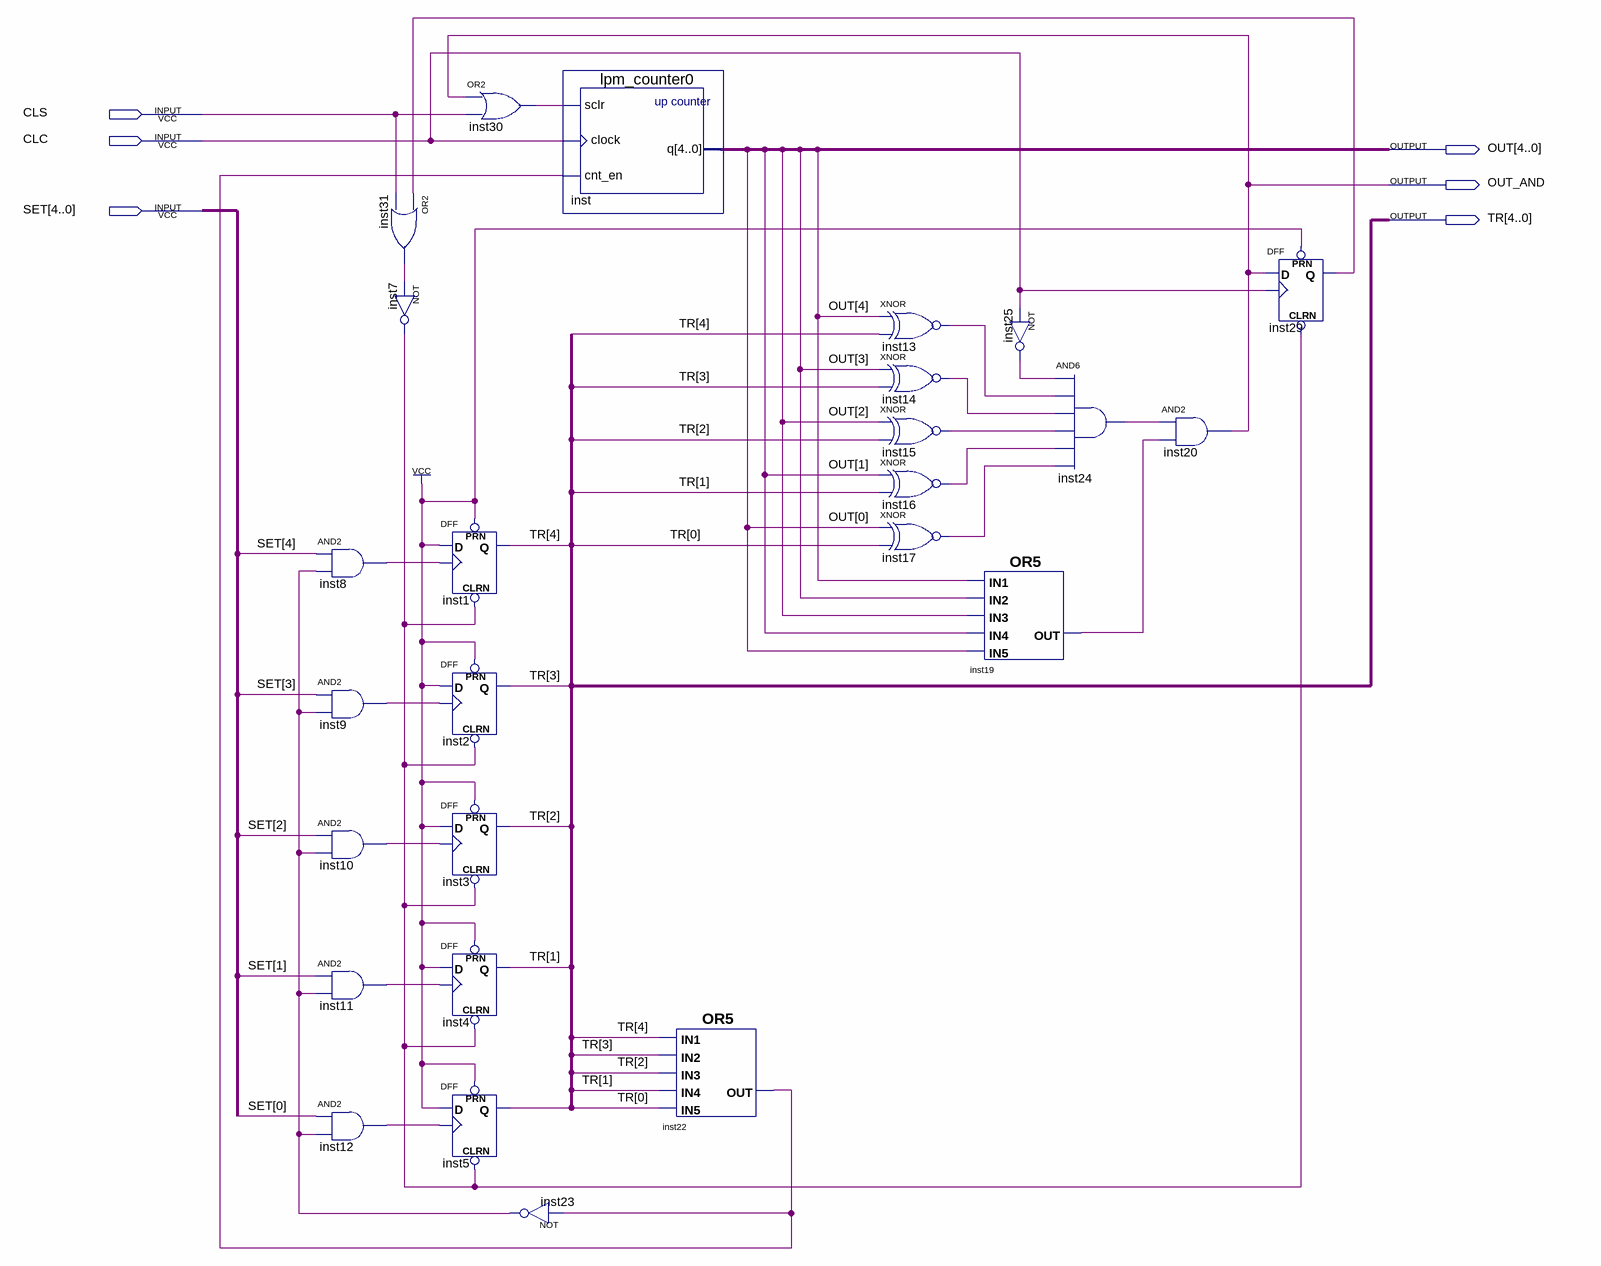
[diagram p0: schematic sheet]
// Quartus schematic COUNTER_LPM.bdf as structural Verilog: 26 symbols, 6 pins
module COUNTER_LPM (
  input  CLS,
  input  CLC,
  input  [4:0] SET,
  output [4:0] OUT,
  output OUT_AND,
  output [4:0] TR
);

  wire inst7_out, inst8_out, inst9_out, inst10_out, inst11_out, inst12_out, inst13_out, inst14_out,
       inst15_out, inst16_out, inst17_out, inst19_out, inst22_out, inst23_out, inst24_out, inst25_out,
       inst29_q, inst30_out, inst31_out;

  and inst8 (inst8_out, SET[4], inst23_out);
  and inst9 (inst9_out, SET[3], inst23_out);
  and inst10 (inst10_out, SET[2], inst23_out);
  and inst11 (inst11_out, SET[1], inst23_out);
  and inst12 (inst12_out, SET[0], inst23_out);
  or inst31 (inst31_out, inst29_q, CLS);
  not inst7 (inst7_out, inst31_out);
  DFF inst1 (.CLRN(inst7_out), .CLK(inst8_out), .D(1'b1), .PRN(1'b1), .Q(TR[4]));
  DFF inst2 (.CLRN(inst7_out), .CLK(inst9_out), .D(1'b1), .PRN(1'b1), .Q(TR[3]));
  DFF inst3 (.CLRN(inst7_out), .CLK(inst10_out), .D(1'b1), .PRN(1'b1), .Q(TR[2]));
  DFF inst4 (.CLRN(inst7_out), .CLK(inst11_out), .D(1'b1), .PRN(1'b1), .Q(TR[1]));
  DFF inst5 (.CLRN(inst7_out), .CLK(inst12_out), .D(1'b1), .PRN(1'b1), .Q(TR[0]));
  or inst30 (inst30_out, OUT_AND, CLS);
  not inst23 (inst23_out, inst22_out);
  lpm_counter0 inst (.sclr(inst30_out), .clock(CLC), .cnt_en(inst22_out), .q(OUT));
  or inst22 (inst22_out, TR[4], TR[3], TR[2], TR[1], TR[0]);
  xnor inst13 (inst13_out, OUT[4], TR[4]);
  xnor inst14 (inst14_out, OUT[3], TR[3]);
  xnor inst15 (inst15_out, OUT[2], TR[2]);
  xnor inst16 (inst16_out, OUT[1], TR[1]);
  xnor inst17 (inst17_out, OUT[0], TR[0]);
  not inst25 (inst25_out, CLC);
  or inst19 (inst19_out, OUT[4], OUT[3], OUT[2], OUT[1], OUT[0]);
  and inst24 (inst24_out, inst25_out, inst13_out, inst14_out, inst15_out, inst16_out, inst17_out);
  and inst20 (OUT_AND, inst24_out, inst19_out);
  DFF inst29 (.CLRN(inst7_out), .CLK(CLC), .D(OUT_AND), .PRN(1'b1), .Q(inst29_q));
endmodule
